# Altium project B_Lock2.PrjPcb
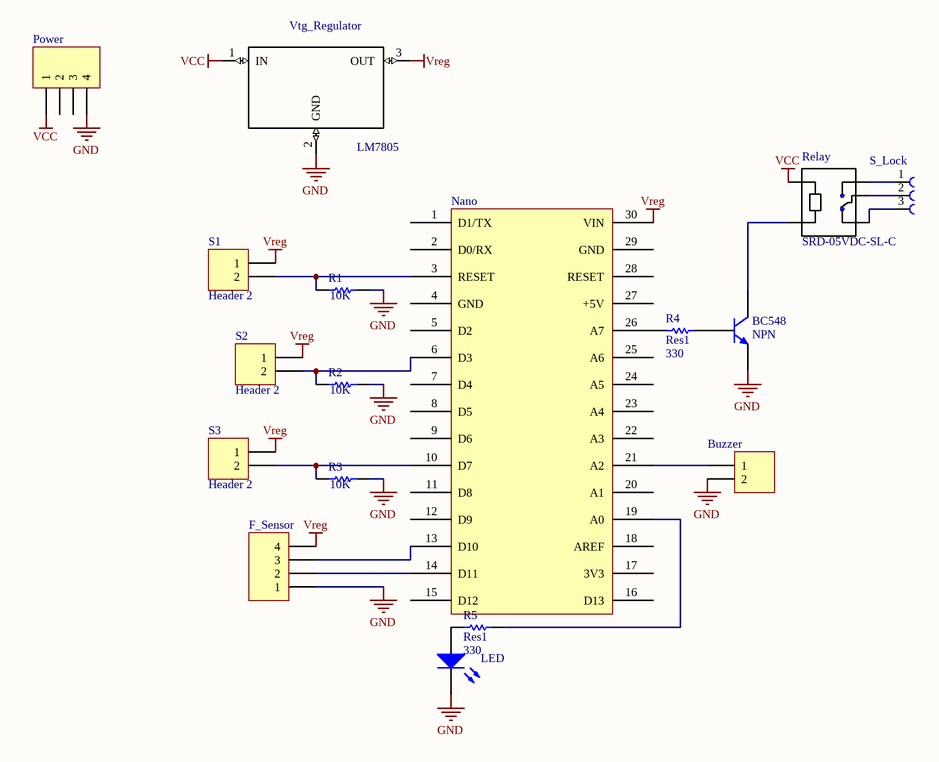
[diagram p0: Circiut.SchDoc]
1 sheet, 17 parts. Net scope: global (net labels, ports and power ports of the same name join across sheets).
Board file: Bio_lock.PcbDoc

## Sheet Circiut.SchDoc
size A4

### Parts
BC548  NPN  [TO-226-AA]
Buzzer  Header 2  [HDR1X2]  (value not drawn)
F_Sensor  Header 4  [HDR1X4]  (value not drawn)
LED  LED0  [LED-0]  (value not drawn)
Nano  ARDUINO NANO  [NANO]  (value not drawn)
Power  Header 4  [HDR1X4]  (value not drawn)
R1  value 10K  [AXIAL-0.3]  (hidden comment: Res1)
R2  value 10K  [AXIAL-0.3]  (hidden comment: Res1)
R3  value 10K  [AXIAL-0.3]  (hidden comment: Res1)
R4  Res1  value 330  [AXIAL-0.3]
R5  Res1  value 330  [AXIAL-0.3]
Relay  SRD-05VDC-SL-C  [*RELAY_SRD-05VDC-SL-C_SRD-05VDC-SL-C(Primary)]
S1  Header 2  [HDR1X2]
S2  Header 2  [HDR1X2]
S3  Header 2  [HDR1X2]
S_Lock  691214110003  [*691214110003]  (value not drawn)
Vtg_Regulator  LM7805  [*TO220]

### Nets
GND: BC548.3(E) Buzzer.2 F_Sensor.1 LED.1(A) Power.4 R1.2 R2.2 R3.2 Vtg_Regulator.2(GND)
VCC: Power.1 Relay.A1 Vtg_Regulator.1(IN)
Vreg: F_Sensor.4 Nano.30(VIN) S1.1 S2.1 S3.1 Vtg_Regulator.3(OUT)
NetBC548_1: BC548.1(C) Relay.A2
NetBC548_2: BC548.2(B) R4.2
NetBuzzer_1: Buzzer.1 Nano.21(A2)
NetF_Sensor_2: F_Sensor.2 Nano.14(D11)
NetF_Sensor_3: F_Sensor.3 Nano.13(D10)
NetLED_2: LED.2(K) R5.1
NetNano_3: Nano.3(RESET) R1.1 S1.2
NetNano_6: Nano.6(D3) R2.1 S2.2
NetNano_10: Nano.10(D7) R3.1 S3.2
NetNano_19: Nano.19(A0) R5.2
NetNano_26: Nano.26(A7) R4.1
NetRelay_COM: Relay.COM S_Lock.2
NetRelay_NC: Relay.NC S_Lock.3
NetRelay_NO: Relay.NO S_Lock.1

Not connected (* = marked no-connect by the designer): Nano 1(D1/TX) 2(D0/RX) 4(GND) 5(D2) 7(D4) 8(D5) 9(D6) 11(D8) 12(D9) 15(D12) 16(D13) 17(3V3) 18(AREF) 20(A1) 22(A3) 23(A4) 24(A5) 25(A6) 27(+5V) 28(RESET) 29(GND); Power 2 3

### Library data of the parts
BC548 = NPN: NPN Bipolar Transistor; Published: 8-Jun-2000; LatestRevisionDate: 17-Jul-2002; LatestRevisionNote: Re-released for DXP Platform.; PackageReference: TO-226-AA; Publisher: Altium Limited; PackageDescription: TO, Flat Index; 3 In-Line, Axial Leads; Body Dia. 4.8mm; Leads 0.55 x 0.51 mm (max); Code_JEDEC: TO-226-AA
Buzzer S1-S3 = Header 2: Header, 2-Pin; LatestRevisionDate: 17-Jul-2002; LatestRevisionNote: Re-released for DXP Platform.; Publisher: Altium Limited
F_Sensor Power = Header 4: Header, 4-Pin; LatestRevisionDate: 17-Jul-2002; LatestRevisionNote: Re-released for DXP Platform.; Publisher: Altium Limited
LED = LED0: Typical INFRARED GaAs LED; Published: 8-Jun-2000; LatestRevisionDate: 08-Jul-2005; LatestRevisionNote: Mech Layer 1 removed.; PackageReference: LED-0; Publisher: Altium Limited; PackageDescription: LED; 2 Leads
Nano = NANO
R1-R5 = Res1: Resistor; Published: 8-Jun-2000; LatestRevisionDate: 17-Jul-2002; LatestRevisionNote: Re-released for DXP Platform.; PackageReference: AXIAL-0.3; Publisher: Altium Limited; PackageDescription: Axial Device, Thru-Hole; 2 Leads; 0.3 in Pin Spacing
Relay = SRD-05VDC-SL-C: 5V Trigger Relay Module For Arduino And Raspberry Pi 5V Trigger Relay Module For Arduino And Raspberry Pi; MF: Songle Relay; SnapEDA_Link: https://www.snapeda.com/parts/SRD-05VDC-SL-C/Songle%20Relay/view-part/1029484/?ref=snap; Availability: Unavailable; Price: None; MP: SRD-05VDC-SL-C; Package: None; Value: *
S_Lock = 691214110003: 3 Position Wire to Board Terminal Block Horizontal with Board 0.138 _3.50mm_ Through Hole; MF: Wurth Electronics; Package: None; Price: None; MP: 691214110003; Availability: Unavailable; SnapEDA_Link: https://www.snapeda.com/parts/691214110003/Wurth%20Electronics%20Inc./view-part/1195098/?ref=snap; Value: *
Vtg_Regulator = LM7805: Linear Voltage Regulator IC 1 Output 1.5A SOT-223-4; MF: Texas Instruments; MP: LM7805; Price: None; Package: TO-220 Texas Instruments; Availability: Unavailable; SnapEDA_Link: https://www.snapeda.com/parts/LM7805/Texas%20Instruments/view-part/2302466/?ref=snap; Value: *